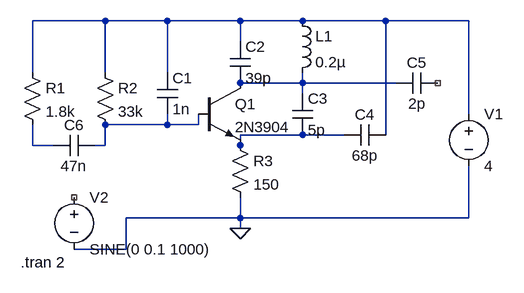
[diagram p0: schematic Draft1.asc]
Draft1.asc, the LTspice schematic file:
Version 4
SHEET 1 880 680
WIRE 240 32 128 32
WIRE 336 32 240 32
WIRE 448 32 336 32
WIRE 544 32 448 32
WIRE 672 32 544 32
WIRE 800 32 672 32
WIRE 448 64 448 32
WIRE 128 112 128 32
WIRE 240 112 240 32
WIRE 336 112 336 32
WIRE 544 128 544 112
WIRE 544 128 448 128
WIRE 688 128 544 128
WIRE 544 144 544 128
WIRE 800 176 800 32
WIRE 336 192 336 176
WIRE 336 192 240 192
WIRE 384 192 384 176
WIRE 384 192 336 192
WIRE 544 208 448 208
WIRE 608 208 544 208
WIRE 672 208 672 32
WIRE 128 224 128 192
WIRE 160 224 128 224
WIRE 240 224 240 192
WIRE 240 224 224 224
WIRE 448 224 448 208
WIRE 448 336 448 304
WIRE 448 336 272 336
WIRE 800 336 800 256
WIRE 800 336 448 336
WIRE 448 352 448 336
WIRE 272 384 272 336
WIRE 272 384 192 384
FLAG 448 352 0
SYMBOL res 112 96 R0
SYMATTR InstName R1
SYMATTR Value 1.8k
SYMBOL res 224 96 R0
SYMATTR InstName R2
SYMATTR Value 33k
SYMBOL cap 320 112 R0
SYMATTR InstName C1
SYMATTR Value 1n
SYMBOL cap 432 64 R0
SYMATTR InstName C2
SYMATTR Value 39p
SYMBOL res 432 208 R0
SYMATTR InstName R3
SYMATTR Value 150
SYMBOL cap 528 144 R0
SYMATTR InstName C3
SYMATTR Value 5p
SYMBOL ind 528 16 R0
SYMATTR InstName L1
SYMATTR Value 0.2µ
SYMBOL cap 672 192 R90
WINDOW 0 0 32 VBottom 2
WINDOW 3 32 32 VTop 2
SYMATTR InstName C4
SYMATTR Value 68p
SYMBOL cap 752 112 R90
WINDOW 0 0 32 VBottom 2
WINDOW 3 32 32 VTop 2
SYMATTR InstName C5
SYMATTR Value 2p
SYMBOL cap 224 208 R90
WINDOW 0 0 32 VBottom 2
WINDOW 3 32 32 VTop 2
SYMATTR InstName C6
SYMATTR Value 47n
SYMBOL npn 384 128 R0
SYMATTR InstName Q1
SYMATTR Value 2N3904
SYMBOL voltage 800 160 R0
WINDOW 123 0 0 Left 0
WINDOW 39 0 0 Left 0
SYMATTR InstName V1
SYMATTR Value 4
SYMBOL voltage 192 288 R0
WINDOW 123 0 0 Left 0
WINDOW 39 0 0 Left 0
SYMATTR InstName V2
SYMATTR Value SINE(0 0.1 1000)
TEXT 110 404 Left 2 !.tran 2

The netlist it stands for:
* Draft1.asc
R1 N001 N005 1.8k
R2 N001 N003 33k
C1 N001 N003 1n
C2 N001 N002 39p
R3 N004 0 150
C3 N002 N004 5p
L1 N001 N002 0.2µ
C4 N001 N004 68p
C5 NC_01 N002 2p
C6 N003 N005 47n
Q1 N002 N003 N004 0 2N3904
V1 N001 0 4
V2 NC_02 0 SINE(0 0.1 1000)
.model NPN NPN
.model PNP PNP
.lib standard.bjt
.tran 2
.backanno
.end